# EAGLE schematic SRAM 4MB 2048kbx8 CPLD proto (EAGLE 6.4)
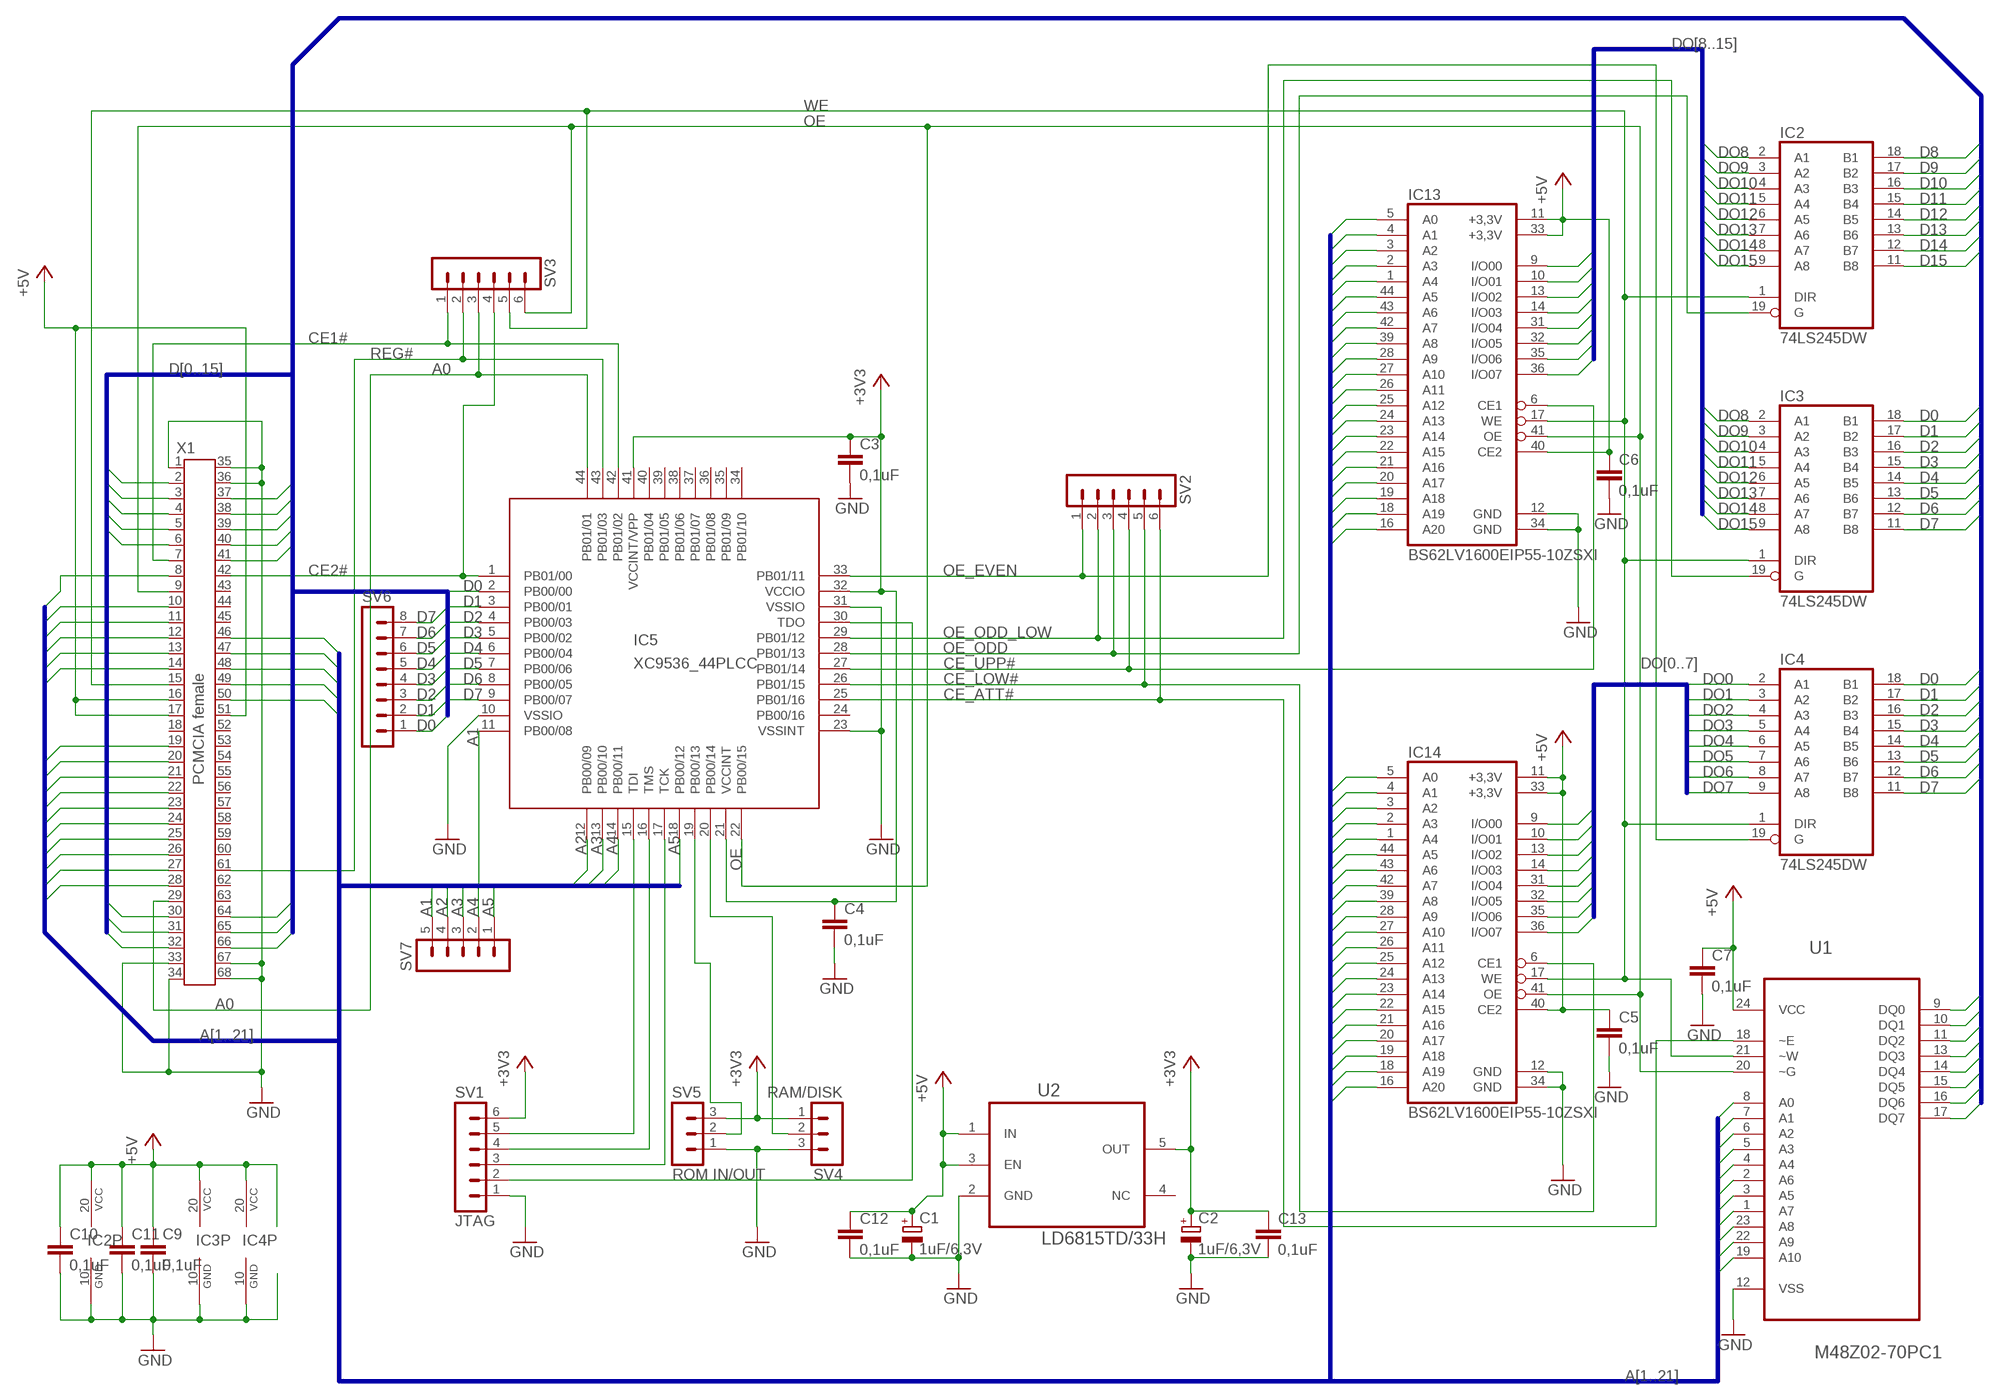
[diagram p0: schematic, sheet 1]

## Parts
C1  1uF/6,3V  CPOL-EUB  [PANASONIC_B]
C2  1uF/6,3V  CPOL-EUB  [PANASONIC_B]
C3  0,1uF  C-EUC0603  [C0603]
C4  0,1uF  C-EUC0603  [C0603]
C5  0,1uF  C-EUC0603  [C0603]
C6  0,1uF  C-EUC0603  [C0603]
C7  0,1uF  C-EUC0603  [C0603]
C9  0,1uF  C-EUC0603  [C0603]
C10  0,1uF  C-EUC0603  [C0603]
C11  0,1uF  C-EUC0603  [C0603]
C12  0,1uF  C-EUC0603  [C0603]
C13  0,1uF  C-EUC0603  [C0603]
IC2  74LS245DW  [SO20W]
IC3  74LS245DW  [SO20W]
IC4  74LS245DW  [SO20W]
IC5  XC9536_44PLCC  [PLCC44]
IC13  BS62LV1600EIP55-10ZSXI  [TSOPII-Z44]
IC14  BS62LV1600EIP55-10ZSXI  [TSOPII-Z44]
SV1  JTAG  MA06-1  [MA06-1]
SV2  MA06-1  [MA06-1]
SV3  MA06-1  [MA06-1]
SV4  RAM/DISK  MA03-1  [MA03-1]
SV5  ROM IN/OUT  MA03-1  [MA03-1]
SV6  MA08-1  [MA08-1]
SV7  MA05-1  [MA05-1]
U1  M48Z02-70PC1  [DIP254P1524X965-24]
U2  LD6815TD/33H  [SOT95P275X110-5N]
X1  PCMCIA female  9M681X03TB9M681Z04  [9M681X04]

## Nets
+3V3 [+3.3V]: C2.+ C3.1 C4.1 C13.1 IC5.21(VCCINT) IC5.32(VCCIO) IC5.41(VCCINT/VPP) SV1.6 SV4.1 SV5.3 U2.5(OUT)
+5V [+5V]: C1.+ C5.1 C6.1 C7.1 C9.1 C10.1 C11.1 C12.1 IC2.20(VCC) IC3.20(VCC) IC4.20(VCC) IC13.11(+3,3V) IC13.33(+3,3V) IC13.40(CE2) IC14.11(+3,3V) IC14.33(+3,3V) IC14.40(CE2) U1.24(VCC) U2.1(IN) U2.3(EN) X1.16 X1.17 X1.51
A0: IC5.44(PB01/01) SV3.3 X1.29
A1: IC5.11(PB00/08) IC13.5(A0) IC14.5(A0) SV7.5 U1.8(A0) X1.28
A2: IC5.12(PB00/09) IC13.4(A1) IC14.4(A1) SV7.4 U1.7(A1) X1.27
A3: IC5.13(PB00/10) IC13.3(A2) IC14.3(A2) SV7.3 U1.6(A2) X1.26
A4: IC5.14(PB00/11) IC13.2(A3) IC14.2(A3) SV7.2 U1.5(A3) X1.25
A5: IC5.18(PB00/12) IC13.1(A4) IC14.1(A4) SV7.1 U1.4(A4) X1.24
A6: IC13.44(A5) IC14.44(A5) U1.2(A6) X1.23
A7: IC13.43(A6) IC14.43(A6) U1.3(A5) X1.22
A8: IC13.42(A7) IC14.42(A7) U1.1(A7) X1.12
A9: IC13.39(A8) IC14.39(A8) U1.23(A8) X1.11
A10: IC13.28(A9) IC14.28(A9) U1.22(A9) X1.8
A11: IC13.27(A10) IC14.27(A10) U1.19(A10) X1.10
A12: IC13.26(A11) IC14.26(A11) X1.21
A13: IC13.25(A12) IC14.25(A12) X1.13
A14: IC13.24(A13) IC14.24(A13) X1.14
A15: IC13.23(A14) IC14.23(A14) X1.20
A16: IC13.22(A15) IC14.22(A15) X1.19
A17: IC13.21(A16) IC14.21(A16) X1.46
A18: IC13.20(A17) IC14.20(A17) X1.47
A19: IC13.19(A18) IC14.19(A18) X1.48
A20: IC13.18(A19) IC14.18(A19) X1.49
A21: IC13.16(A20) IC14.16(A20) X1.50
CE1#: IC5.42(PB01/02) SV3.1 X1.7
CE2#: IC5.1(PB01/00) SV3.4 X1.42
CE_ATT#: IC5.25(PB01/16) SV2.6 U1.18(~E)
CE_LOW#: IC5.26(PB01/15) IC14.6(CE1) SV2.5
CE_UPP#: IC5.27(PB01/14) IC13.6(CE1) SV2.4
D0: IC3.18(B1) IC4.18(B1) IC5.2(PB00/00) SV6.1 U1.9(DQ0) X1.30
D1: IC3.17(B2) IC4.17(B2) IC5.3(PB00/01) SV6.2 U1.10(DQ1) X1.31
D2: IC3.16(B3) IC4.16(B3) IC5.4(PB00/03) SV6.3 U1.11(DQ2) X1.32
D3: IC3.15(B4) IC4.15(B4) IC5.5(PB00/02) SV6.4 U1.13(DQ3) X1.2
D4: IC3.14(B5) IC4.14(B5) IC5.6(PB00/04) SV6.5 U1.14(DQ4) X1.3
D5: IC3.13(B6) IC4.13(B6) IC5.7(PB00/06) SV6.6 U1.15(DQ5) X1.4
D6: IC3.12(B7) IC4.12(B7) IC5.8(PB00/05) SV6.7 U1.16(DQ6) X1.5
D7: IC3.11(B8) IC4.11(B8) IC5.9(PB00/07) SV6.8 U1.17(DQ7) X1.6
D8: IC2.18(B1) X1.64
D9: IC2.17(B2) X1.65
D10: IC2.16(B3) X1.66
D11: IC2.15(B4) X1.37
D12: IC2.14(B5) X1.38
D13: IC2.13(B6) X1.39
D14: IC2.12(B7) X1.40
D15: IC2.11(B8) X1.41
DO0: IC4.2(A1) IC14.9(I/O00)
DO1: IC4.3(A2) IC14.10(I/O01)
DO2: IC4.4(A3) IC14.13(I/O02)
DO3: IC4.5(A4) IC14.14(I/O03)
DO4: IC4.6(A5) IC14.31(I/O04)
DO5: IC4.7(A6) IC14.32(I/O05)
DO6: IC4.8(A7) IC14.35(I/O06)
DO7: IC4.9(A8) IC14.36(I/O07)
DO8: IC2.2(A1) IC3.2(A1) IC13.9(I/O00)
DO9: IC2.3(A2) IC3.3(A2) IC13.10(I/O01)
DO10: IC2.4(A3) IC3.4(A3) IC13.13(I/O02)
DO11: IC2.5(A4) IC3.5(A4) IC13.14(I/O03)
DO12: IC2.6(A5) IC3.6(A5) IC13.31(I/O04)
DO13: IC2.7(A6) IC3.7(A6) IC13.32(I/O05)
DO14: IC2.8(A7) IC3.8(A7) IC13.35(I/O06)
DO15: IC2.9(A8) IC3.9(A8) IC13.36(I/O07)
GND [Ground]: C1.- C2.- C3.2 C4.2 C5.2 C6.2 C7.2 C9.2 C10.2 C11.2 C12.2 C13.2 IC2.10(GND) IC3.10(GND) IC4.10(GND) IC5.10(VSSIO) IC5.23(VSSINT) IC5.31(VSSIO) IC13.12(GND) IC13.34(GND) IC14.12(GND) IC14.34(GND) SV1.1 SV4.3 SV5.1 U1.12(VSS) U2.2(GND) X1.1 X1.33 X1.34 X1.35 X1.36 X1.67 X1.68
N$1: IC5.30(TDO) SV1.2
N$2: IC5.17(TCK) SV1.3
N$3: IC5.16(TMS) SV1.4
N$4: IC5.15(TDI) SV1.5
N$7: IC5.19(PB00/13) SV5.2
N$8: IC5.20(PB00/14) SV4.2
OE: IC5.22(PB00/15) IC13.41(OE) IC14.41(OE) SV3.6 U1.20(~G) X1.9
OE_EVEN: IC4.19(G) IC5.33(PB01/11) SV2.1
OE_ODD: IC2.19(G) IC5.28(PB01/13) SV2.3
OE_ODD_LOW: IC3.19(G) IC5.29(PB01/12) SV2.2
REG#: IC5.43(PB01/03) SV3.2 X1.61
WE: IC2.1(DIR) IC3.1(DIR) IC4.1(DIR) IC13.17(WE) IC14.17(WE) SV3.5 U1.21(~W) X1.15
Unconnected: IC5.24(PB00/16) IC5.34(PB01/10) IC5.35(PB01/09) IC5.36(PB01/08) IC5.37(PB01/07) IC5.38(PB01/06) IC5.39(PB01/05) IC5.40(PB01/04) U2.4(NC) X1.18 X1.43 X1.44 X1.45 X1.52 X1.53 X1.54 X1.55 X1.56 X1.57 X1.58 X1.59 X1.60 X1.62 X1.63

## Buses
DO[8..15]
DO[0..7]
D[0..15]
A[1..21]

## Library data of the parts
C1 C2 = resistor:CPOL-EU: POLARIZED CAPACITOR, European symbol
C3-C7 C9-C13 = resistor:C-EU: CAPACITOR, European symbol
IC2-IC4 = 74xx-us:74*245: Octal BUS TRANSCEIVER, 3-state
IC5 = xilinx-xc9:XC9536_44PLCC: xc9536_pc44 XC9500 In-System Programmable CPLD Family Auto generated by make-symbol-device-package-bsdl.ulp Rev. 34 Source: xc9536_pc44.bsd; MPN: XC9536-15PCG44C; OC_FARNELL: 1193226; OC_NEWARK: 98K3376
IC13 IC14 = BSI_By_element14_Batch_1:BS62LV1600EIP55: Source: CYPRESS cy7c1059dv33_8.pdf
SV1-SV3 = con-lstb:MA06-1: PIN HEADER; OC_FARNELL: unknown; OC_NEWARK: unknown
SV4 SV5 = con-lstb:MA03-1: PIN HEADER; OC_FARNELL: unknown; OC_NEWARK: unknown
SV6 = con-lstb:MA08-1: PIN HEADER; OC_FARNELL: unknown; OC_NEWARK: unknown
SV7 = con-lstb:MA05-1: PIN HEADER; OC_FARNELL: unknown; OC_NEWARK: unknown
U1 = ST Microelctronics_By_element14_Batch_1:M48Z02-70PC1: 5 V, 16 Kbit (2 Kb x 8) ZEROPOWER® SRAM; MPN: M48Z02-70PC1; OC_FARNELL: 9755748; OC_NEWARK: 89K1473; PACKAGE: PDIP-24; SUPPLIER: STMICROELECTRONICS
U2 = NXP:LD6815TD/33H: LDO, 5.5V, 0.25VDO, 0.15A, 3.3V, 5TSOP; MPN: LD6815TD/33H; OC_FARNELL: 2308302; OC_NEWARK: 69W9575; PACKAGE: TSOP-5; SUPPLIER: NXP
X1 = 3M:9M681X03TB

## Net classes
0 default: width 0.254 mm
1 Ground: width 0.457 mm
2 +5V: width 0.457 mm
3 +3.3V: width 0.356 mm